# Altium schematic sheet FTDI.SchDoc
size A3; SheetNumber: 8; SheetTotal: 15
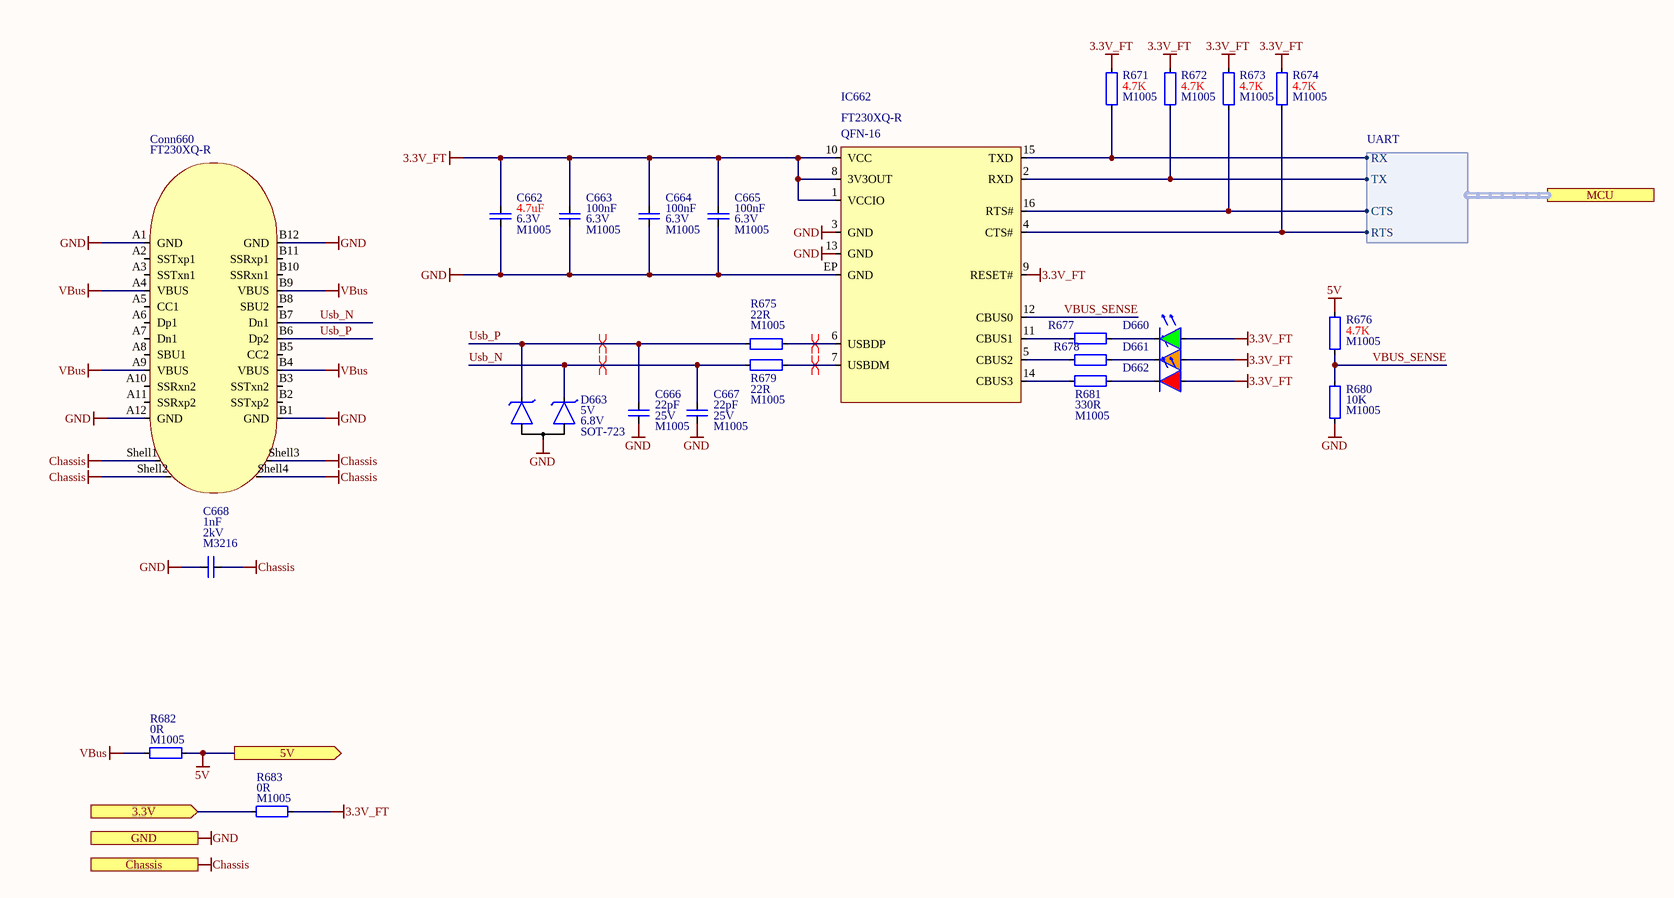
[diagram p0: FTDI.SchDoc]

## Parts
C662  value 4.7uF  Voltage: 6.3V  Package: M1005  [Capacitor_Ceramic_M1005_I0402]  (hidden comment: Capacitor_Ceramic)
C663  value 100nF  Voltage: 6.3V  Package: M1005  [Capacitor_Ceramic_M1005_I0402]  (hidden comment: Capacitor_Ceramic)
C664  value 100nF  Voltage: 6.3V  Package: M1005  [Capacitor_Ceramic_M1005_I0402]  (hidden comment: Capacitor_Ceramic)
C665  value 100nF  Voltage: 6.3V  Package: M1005  [Capacitor_Ceramic_M1005_I0402]  (hidden comment: Capacitor_Ceramic)
C666  value 22pF  Voltage: 25V  Package: M1005  [Capacitor_Ceramic_M1005_I0402]  (hidden comment: Capacitor_Ceramic)
C667  value 22pF  Voltage: 25V  Package: M1005  [Capacitor_Ceramic_M1005_I0402]  (hidden comment: Capacitor_Ceramic)
C668  value 1nF  Voltage: 2kV  Package: M3216  [Capacitor_Ceramic_M3216_I1206]  (hidden comment: Capacitor_Ceramic)
Conn660  Manufacturer Part number: FT230XQ-R  [GCT, USB4056]  (hidden comment: GCT, USB4056)
D660  Diode_Led  [Diode_Smd_M1608_I0603_Green-Yellow]  (value not drawn)
D661  Diode_Led  [Diode_Smd_M1608_I0603_Orange1]  (value not drawn)
D662  Diode_Led  [Diode_Smd_M1608_I0603_Red]  (value not drawn)
D663  Voltage, Break Down: 6.8V  Voltage, Stand Off: 5V  Package: SOT-723  [Diode_SOT-723_2P_Common_Anode_Type_1]  (hidden comment: Diode_Tvs_2P_Common_Anode)
IC662  Manufacturer Part number: FT230XQ-R  Package: QFN-16  [QFN-16, 4mm x 4mm, 0.65mm]  (hidden comment: FTDI_FT230XQ)
R671  value 4.7K  Package: M1005  [Resistor_Smd_M1005_I0402]  (hidden comment: Resistor)
R672  value 4.7K  Package: M1005  [Resistor_Smd_M1005_I0402]  (hidden comment: Resistor)
R673  value 4.7K  Package: M1005  [Resistor_Smd_M1005_I0402]  (hidden comment: Resistor)
R674  value 4.7K  Package: M1005  [Resistor_Smd_M1005_I0402]  (hidden comment: Resistor)
R675  value 22R  Package: M1005  [Resistor_Smd_M1005_I0402]  (hidden comment: Resistor)
R676  value 4.7K  Package: M1005  [Resistor_Smd_M1005_I0402]  (hidden comment: Resistor)
R677  Resistor  [Resistor_Smd_M1005_I0402]  (value not drawn)
R678  Resistor  [Resistor_Smd_M1005_I0402]  (value not drawn)
R679  value 22R  Package: M1005  [Resistor_Smd_M1005_I0402]  (hidden comment: Resistor)
R680  value 10K  Package: M1005  [Resistor_Smd_M1005_I0402]  (hidden comment: Resistor)
R681  value 330R  Package: M1005  [Resistor_Smd_M1005_I0402]  (hidden comment: Resistor)
R682  value 0R  Package: M1005  [Resistor_Smd_M1005_I0402]  (hidden comment: Resistor)
R683  value 0R  Package: M1005  [Resistor_Smd_M1005_I0402]  (hidden comment: Resistor)

## Ports
3.3V (in), 5V (out), Chassis (in), GND (in), MCU (harness UART)

## Harnesses
UART: RX, TX, RTS, CTS

## Nets
3.3V_FT: C662.1 C663.1 C664.1 C665.1 D660.A D661.A D662.A IC662.1(VCCIO) IC662.8(3V3OUT) IC662.9(RESET#) IC662.10(VCC) R671.1 R672.1 R673.1 R674.1 R683.2
5V: R676.1 R682.2 ; port 5V
Chassis: C668.2 Conn660.Shell1(Chassis1) Conn660.Shell2(Chassis2) Conn660.Shell3(Chassis3) Conn660.Shell4(Chassis4) ; port Chassis
GND: C662.2 C663.2 C664.2 C665.2 C666.2 C667.2 C668.1 Conn660.A1(GND) Conn660.A12(GND) Conn660.B1(GND) Conn660.B12(GND) D663.A IC662.3(GND) IC662.13(GND) IC662.EP(GND) R680.2 ; port GND
VBus: Conn660.A4(VBUS) Conn660.A9(VBUS) Conn660.B4(VBUS) Conn660.B9(VBUS) R682.1
3.3V: R683.1 ; port 3.3V
Usb_N: C667.1 Conn660.B7(Dn1) D663.C2 R679.1
Usb_P: C666.1 Conn660.B6(Dp2) D663.C1 R675.1
VBUS_SENSE: IC662.12(CBUS0) R676.2 R680.1
NetD660_C: D660.C R677.2
NetD661_C: D661.C R678.2
NetD662_C: D662.C R681.2
NetIC662_2: IC662.2(RXD) R672.2 ; port MCU.TX
NetIC662_4: IC662.4(CTS#) R674.2 ; port MCU.RTS
NetIC662_5: IC662.5(CBUS2) R678.1
NetIC662_6: IC662.6(USBDP) R675.2
NetIC662_7: IC662.7(USBDM) R679.2
NetIC662_11: IC662.11(CBUS1) R677.1
NetIC662_14: IC662.14(CBUS3) R681.1
NetIC662_15: IC662.15(TXD) R671.2 ; port MCU.RX
NetIC662_16: IC662.16(RTS#) R673.2 ; port MCU.CTS

Not connected (* = marked no-connect by the designer): Conn660 A2(SSTxp1) A3(SSTxn1) A5(CC1) A6(Dp1) A7(Dn1) A8(SBU1) A10(SSRxn2) A11(SSRxp2) B2(SSTxp2) B3(SSTxn2) B5(CC2) B8(SBU2) B10(SSRxn1) B11(SSRxp1)

## Layout directives
differential pair: NetIC662_6, NetIC662_7, Usb_N, Usb_P

## Library data of the parts
C662-C665 = Capacitor_Ceramic: Cap, Cer, 100nF, 6.3V, M1005; Manufacturer Part Number: 04026D104KAT4A; Manufacturer: Kyocera; Temperature Coefficient: X5R; Tolerance: 10%; ComponentLink1Description: Datasheet; ComponentLink1URL: E:\Altium\Datasheets\Capacitor\Kyocera - X5R.pdf; ComponentLink2Description: Supplier Link; ComponentLink2URL: https://www.digikey.com/en/products/detail/kyocera-avx/04026D104KAT4A/8107673; Supplier: Digikey; Supplier Part Number: 478-11504-1-ND; Operating Temperature, Min: +85℃; Operating Temperature, Max: -55℃; Quantity, Min: 1; Quantity, Max: 250000; Price, Min: 0.1; Supplier Currency: $; Price, Max: 0.00189; Supplier Link: https://www.digikey.com/en/products/detail/kyocera-avx/04026D104KAT4A/8107673; Component Type: Ceramic; Component Category: Capacitor
C666 C667 = Capacitor_Ceramic: Cap, Cer, 22pF, 25V, M1005; Manufacturer Part Number: 0402N220J250CT; Manufacturer: Walsin; Temperature Coefficient: C0G, NP0; Tolerance: 5%; ComponentLink1Description: Datasheet; ComponentLink1URL: E:\Altium\Datasheets\Capacitor\Walsin - Multilayer Ceramic Capacitors.pdf; ComponentLink2Description: Supplier Link; ComponentLink2URL: https://www.digikey.com/en/products/detail/walsin-technology-corporation/0402N220J250CT/9354779; Supplier: Digikey; Supplier Part Number: 1292-1282-1-ND; Operating Temperature, Min: +125℃; Operating Temperature, Max: -55℃; Quantity, Min: 1; Quantity, Max: 250000; Price, Min: 0.1; Supplier Currency: $; Price, Max: 0.00177; Supplier Link: https://www.digikey.com/en/products/detail/walsin-technology-corporation/0402N220J250CT/9354779; Component Type: Ceramic; Component Category: Capacitor
C668 = Capacitor_Ceramic: Cap, Cer, 1nF, 2kV, M3216; Manufacturer Part Number: CC1206MKX7RDBB102; Manufacturer: Yageo; Temperature Coefficient: X7R; Tolerance: 20%; ComponentLink1Description: Datasheet; ComponentLink1URL: E:\Altium\Datasheets\Capacitor\Yageo - Surface-Mount Ceramic Multilayer Capacitors.pdf; ComponentLink2Description: Supplier Link; ComponentLink2URL: https://www.digikey.com/en/products/detail/yageo/CC1206MKX7RDBB102/5884663; Supplier: Digikey; Supplier Part Number: 311-4501-1-ND; Operating Temperature, Min: +125℃; Operating Temperature, Max: -55℃; Quantity, Min: 1; Quantity, Max: 300000; Price, Min: 0.23; Supplier Currency: $; Price, Max: 0.03271; Supplier Link: https://www.digikey.com/en/products/detail/yageo/CC1206MKX7RDBB102/5884663; Component Type: Ceramic; Component Category: Capacitor
Conn660 = GCT, USB4056: IC,Interface,FTDI,QFN16; component category: capacitor*; ComponentLink1Description: datasheet; ComponentLink1URL: *; ComponentLink2Description: supplier link; ComponentLink2URL: *; component type: ceramic; supplier link: *; supplier currency: *; price,max: *; price,min: *; Quantity,max: *; Quantity,min: *; Operating Temparature,max: +85; Operating Temparature,min: -40; Supplier Part number: *; Supplier: Digikey; Manufacturer: FTDI; Package: SOP-8
D660 = Diode_Led: Diode, Led, Green-Yellow, 2.2V, 20mA, M1608; Manufacturer Part Number: SML-D12M1WT86; Manufacturer: Rohm; ComponentLink1Description: Datasheet; ComponentLink1URL: E:\Altium\Datasheets\Diode\Rohm, SML-D12x1 Series.pdf; ComponentLink2Description: Supplier Link; ComponentLink2URL: https://www.digikey.com/en/products/detail/rohm-semiconductor/SML-D12M1WT86/5843856; Supplier: Digikey; Supplier Part Number: SML-D12M1WT86CT-ND; Operating Temperature, Min: -40℃; Operating Temperature, Max: +85℃; Quantity, Min: 1; Quantity, Max: 75000; Price, Min: 0.25; Price, Max: 0.02838; Supplier Currency: $; Supplier Link: https://www.digikey.com/en/products/detail/rohm-semiconductor/SML-D12M1WT86/5843856; Component Type: Led; Component Category: Diode; Current: 20mA; Voltage: 2.2V; Package: M1608
D661 = Diode_Led: Diode, Led, Orange, 2.2V, 20mA, M1608; Manufacturer Part Number: SML-D12D1WT86; Manufacturer: Rohm; ComponentLink1Description: Datasheet; ComponentLink1URL: E:\Altium\Datasheets\Diode\Rohm, SML-D12x1 Series.pdf; ComponentLink2Description: Supplier Link; ComponentLink2URL: https://www.digikey.com/en/products/detail/rohm-semiconductor/SML-D12D1WT86/5843854; Supplier: Digikey; Supplier Part Number: SML-D12D1WT86CT-ND; Operating Temperature, Min: -40℃; Operating Temperature, Max: +85℃; Quantity, Min: 1; Quantity, Max: 75000; Price, Min: 0.25; Price, Max: 0.02838; Supplier Currency: $; Supplier Link: https://www.digikey.com/en/products/detail/rohm-semiconductor/SML-D12D1WT86/5843854; Component Type: Led; Component Category: Diode; Current: 20mA; Voltage: 2.2V; Package: M1608
D662 = Diode_Led: Diode, Led, Red, 2.2V, 20mA, M1608; Manufacturer Part Number: SML-D12U1WT86; Manufacturer: Rohm; ComponentLink1Description: Datasheet; ComponentLink1URL: E:\Altium\Datasheets\Diode\Rohm, SML-D12x1 Series.pdf; ComponentLink2Description: Supplier Link; ComponentLink2URL: https://www.digikey.com/en/products/detail/rohm-semiconductor/SML-D12U1WT86/5843853; Supplier: Digikey; Supplier Part Number: SML-D12U1WT86CT-ND; Operating Temperature, Min: -40℃; Operating Temperature, Max: +85℃; Quantity, Min: 1; Quantity, Max: 75000; Price, Min: 0.25; Price, Max: 0.02838; Supplier Currency: $; Supplier Link: https://www.digikey.com/en/products/detail/rohm-semiconductor/SML-D12U1WT86/5843853; Component Type: Led; Component Category: Diode; Current: 20mA; Voltage: 2.2V; Package: M1608
D663 = Diode_Tvs_2P_Common_Anode: Diode, TVS, 5V/6.8V, SOD-723; Manufacturer Part Number: DF3A6.8LFV,L3F; Manufacturer: Toshiba; ComponentLink1Description: Datasheet; ComponentLink1URL: E:\Altium\Datasheets\Diode\Toshiba, DF3A6.8LFV.pdf; ComponentLink2Description: Supplier Link; ComponentLink2URL: https://www.digikey.com/en/products/detail/toshiba-semiconductor-and-storage/DF3A6-8LFV-L3F/4305070; Supplier: Digikey; Supplier Part Number: DF3A6.8LFVL3FCT-ND; Operating Temperature, Min: ---℃; Operating Temperature, Max: ---℃; Quantity, Min: 1; Quantity, Max: 200000; Price, Min: 0.25; Price, Max: 0.027; Supplier Currency: $; Supplier Link: https://www.digikey.com/en/products/detail/toshiba-semiconductor-and-storage/DF3A6-8LFV-L3F/4305070; Component Type: Tvs; Component Category: Diode
IC662 = FTDI_FT230XQ: IC,Interface,FTDI,QFN16; component category: capacitor*; ComponentLink1Description: datasheet; ComponentLink1URL: *; ComponentLink2Description: supplier link; ComponentLink2URL: *; component type: ceramic; supplier link: *; supplier currency: *; price,max: *; price,min: *; Quantity,max: *; Quantity,min: *; Operating Temparature,max: +85; Operating Temparature,min: -40; Supplier Part number: *; Supplier: Digikey; Manufacturer: FTDI
R671-R674 R676 R680 = Resistor: Res, 10K, 1%, M1005; Manufacturer: Yageo; Manufacturer Part Number: RC0402FR-0710KP; Component Category: Resistor; Component Type: Fixed Value; Tolerance: 1%; Supplier Link: https://www.digikey.com/en/products/detail/yageo/RC0402FR-0710KP/4935264; Supplier Currency: $; Price, Max: 0.00282; Price, Min: 0.1; Quantity, Max: 100000; Quantity, Min: 1; Operating Temperature, Max: -55℃; Operating Temperature, Min: +155℃; Supplier Part Number: YAG1249CT-ND; Supplier: Digikey; ComponentLink1Description: Datasheet; ComponentLink1URL: E:\Altium\Datasheets\Resistor\Yageo - RC_L Series.pdf; ComponentLink2Description: Supplier Link; ComponentLink2URL: https://www.digikey.com/en/products/detail/yageo/RC0402FR-0710KP/4935264
R675 R679 = Resistor: Res, 22R, 1%, M1005; Manufacturer: Yageo; Manufacturer Part Number: RC0402FR-0722RL; Component Category: Resistor; Component Type: Fixed Value; Tolerance: 1%; Supplier Link: https://www.digikey.com/en/products/detail/yageo/RC0402FR-0722RL/726562; Supplier Currency: $; Price, Max: 0.00129; Price, Min: 0.1; Quantity, Max: 100000; Quantity, Min: 1; Operating Temperature, Max: -55℃; Operating Temperature, Min: +155℃; Supplier Part Number: 311-22.0LRCT-ND; Supplier: Digikey; ComponentLink1Description: Datasheet; ComponentLink1URL: E:\Altium\Datasheets\Resistor\Yageo - RC_L Series.pdf; ComponentLink2Description: Supplier Link; ComponentLink2URL: https://www.digikey.com/en/products/detail/yageo/RC0402FR-0722RL/726562
R677 R678 R681 = Resistor: Res, 330R, 1%, M1005; Manufacturer: Yageo; Manufacturer Part Number: RC0402FR-07330RL; Component Category: Resistor; Component Type: Fixed Value; Tolerance: 1%; Supplier Link: https://www.digikey.com/en/products/detail/yageo/RC0402FR-07330RL/726594; Supplier Currency: $; Price, Max: 0.00129; Price, Min: 0.1; Quantity, Max: 100000; Quantity, Min: 1; Operating Temperature, Max: -55℃; Operating Temperature, Min: +155℃; Supplier Part Number: 311-330LRCT-ND; Supplier: Digikey; ComponentLink1Description: Datasheet; ComponentLink1URL: E:\Altium\Datasheets\Resistor\Yageo - RC_L Series.pdf; ComponentLink2Description: Supplier Link; ComponentLink2URL: https://www.digikey.com/en/products/detail/yageo/RC0402FR-07330RL/726594
  R677 R678: Value: 330R; Package: M1005
R682 R683 = Resistor: Res, 0R, M1005; Manufacturer: Yageo; Manufacturer Part Number: RC0402FR-070RL; Component Category: Resistor; Component Type: Fixed Value; Tolerance: *; Supplier Link: https://www.digikey.com/en/products/detail/yageo/RC0402FR-070RL/2827570; Supplier Currency: $; Price, Max: 0.00109; Price, Min: 0.1; Quantity, Max: 50000; Quantity, Min: 1; Operating Temperature, Max: -55℃; Operating Temperature, Min: +155℃; Supplier Part Number: 311-0.0LRCT-ND; Supplier: Digikey; ComponentLink1Description: Datasheet; ComponentLink1URL: E:\Altium\Datasheets\Resistor\Yageo - RC_L Series.pdf; ComponentLink2Description: Supplier Link; ComponentLink2URL: https://www.digikey.com/en/products/detail/yageo/RC0402FR-070RL/2827570